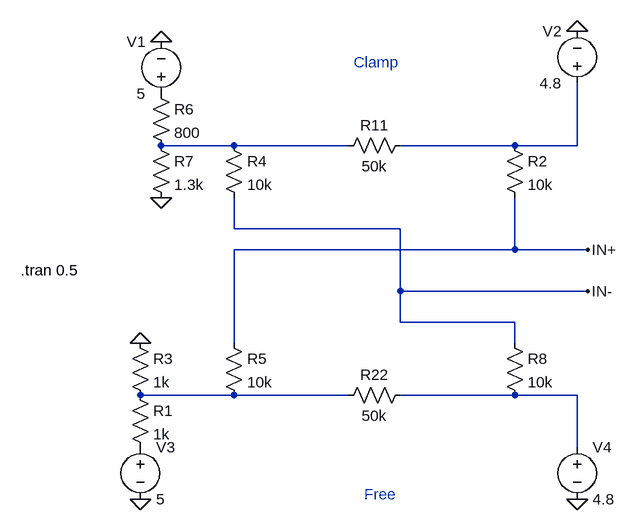
[diagram p0: schematic single_edge.asc]
single_edge.asc, the LTspice schematic file:
Version 4
SHEET 1 880 720
WIRE 0 80 -112 80
WIRE 176 80 0 80
WIRE 432 80 256 80
WIRE 528 80 528 -16
WIRE 528 80 432 80
WIRE 0 208 0 160
WIRE 256 208 0 208
WIRE 432 240 432 160
WIRE 432 240 0 240
WIRE 544 240 432 240
WIRE 256 304 256 208
WIRE 544 304 256 304
WIRE 256 352 256 304
WIRE 432 352 256 352
WIRE 0 384 0 240
WIRE 432 384 432 352
WIRE 0 464 -144 464
WIRE 176 464 0 464
WIRE 432 464 256 464
WIRE 528 464 432 464
WIRE 528 544 528 464
FLAG 528 -96 0
FLAG 528 624 0
FLAG 544 240 IN+
FLAG 544 304 IN-
FLAG -112 -80 0
FLAG -144 624 0
FLAG -144 384 0
FLAG -112 160 0
SYMBOL res 272 64 R90
WINDOW 0 0 56 VBottom 2
WINDOW 3 32 56 VTop 2
SYMATTR InstName R11
SYMATTR Value 50k
SYMBOL res 272 448 R90
WINDOW 0 0 56 VBottom 2
WINDOW 3 32 56 VTop 2
SYMATTR InstName R22
SYMATTR Value 50k
SYMBOL res 416 64 R0
SYMATTR InstName R2
SYMATTR Value 10k
SYMBOL res -16 64 R0
SYMATTR InstName R4
SYMATTR Value 10k
SYMBOL res -16 368 R0
SYMATTR InstName R5
SYMATTR Value 10k
SYMBOL res 416 368 R0
SYMATTR InstName R8
SYMATTR Value 10k
SYMBOL voltage 528 0 R180
WINDOW 0 24 96 Left 2
WINDOW 3 24 16 Left 2
WINDOW 123 0 0 Left 0
WINDOW 39 0 0 Left 0
SYMATTR InstName V2
SYMATTR Value 4.8
SYMBOL voltage 528 528 R0
WINDOW 123 0 0 Left 0
WINDOW 39 0 0 Left 0
SYMATTR InstName V4
SYMATTR Value 4.8
SYMBOL voltage -112 16 R180
WINDOW 0 24 96 Left 2
WINDOW 3 24 16 Left 2
WINDOW 123 0 0 Left 0
WINDOW 39 0 0 Left 0
SYMATTR InstName V1
SYMATTR Value 5
SYMBOL voltage -144 528 R0
WINDOW 123 0 0 Left 0
WINDOW 39 0 0 Left 0
SYMATTR InstName V3
SYMATTR Value 5
SYMBOL res -160 448 R0
SYMATTR InstName R1
SYMATTR Value 1k
SYMBOL res -160 368 R0
SYMATTR InstName R3
SYMATTR Value 1k
SYMBOL res -128 -16 R0
SYMATTR InstName R6
SYMATTR Value 800
SYMBOL res -128 64 R0
SYMATTR InstName R7
SYMATTR Value 1.3k
TEXT 200 616 Left 2 ;Free
TEXT 184 -48 Left 2 ;Clamp
TEXT -328 272 Left 2 !.tran 0.5

The netlist it stands for:
* single_edge.asc
R11 N002 N001 50k
R22 N004 N003 50k
R2 N002 IN+ 10k
R4 N001 IN- 10k
R5 IN+ N003 10k
R8 IN- N004 10k
V2 N002 0 4.8
V4 N004 0 4.8
V1 P001 0 5
V3 P002 0 5
R1 N003 P002 1k
R3 0 N003 1k
R6 P001 N001 800
R7 N001 0 1.3k
* Free
* Clamp
.tran 0.5
.backanno
.end